# EAGLE design Digital Clock v1 (EAGLE 5.11)
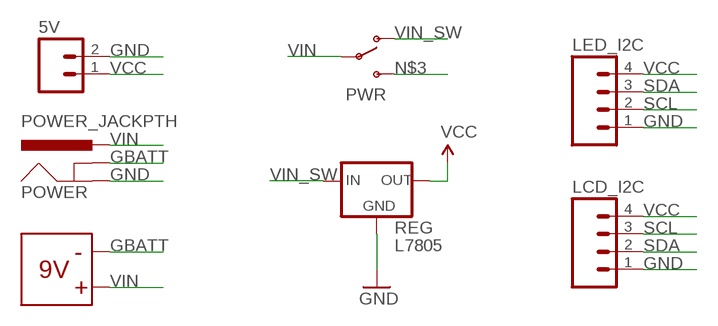
[diagram p0: schematic, sheet 1]

## Parts
5V  M02  [1X02_LONGPADS]
9V_BATTERY  BATTERY-BH9V  [BATTERY-BH9V]
LCD_I2C  M04LONGPADS  [1X04_LONGPADS]
LED_I2C  M04LONGPADS  [1X04_LONGPADS]
POWER  POWER_JACKPTH  [POWER_JACK_PTH]
PWR  SWITCH-SPSTPTH  [SWITCH-SPDT]
REG  L7805  V_REG_78XXSIDE  [78XXL]

## Nets
GBATT [supply]: 9V_BATTERY.9V- POWER.GNDBREAK
GND [supply]: 5V.2 LCD_I2C.1 LED_I2C.1 POWER.GND REG.GND
N$3: PWR.3(S)
SCL: LCD_I2C.3 LED_I2C.2
SDA: LCD_I2C.2 LED_I2C.3
VCC [supply]: 5V.1 LCD_I2C.4 LED_I2C.4 REG.OUT
VIN [supply]: 9V_BATTERY.9V+ POWER.PWR PWR.2(P)
VIN_SW [supply]: PWR.1(O) REG.IN

## Library data of the parts
5V = SparkFun:M02: Header 2 Standard 2-pin 0.1" header. Use with straight break away headers (SKU : PRT-00116), right angle break away headers (PRT-00553), swiss pins (PRT-00743), machine pins (PRT-00117), and female headers (PRT-00115). Molex polarized connector foot print use with SKU : PRT-08233 with associated crimp pins and housings.
9V_BATTERY = jcole:BATTERY-BH9V: Battery holder for 9V batteries, Digikey PN BH9V-PC-ND
LCD_I2C LED_I2C = SparkFun:M04: Header 4 Standard 4-pin 0.1" header. Use with straight break away headers (SKU : PRT-00116), right angle break away headers (PRT-00553), swiss pins (PRT-00743), machine pins (PRT-00117), and female headers (PRT-00115). Molex polarized connector foot print use with SKU : PRT-08231 with associated crimp pins and housings.
POWER = SparkFun:POWER_JACK: Power Jack This is the standard 5.5mm barrel jack for power. The PTH is the most common, proven, reliable, footprint. All others are experimental. The Slot footprint only works if the mill layer is transmitted to the PCB fab house so be warned. Spark Fun Electronics SKU : PRT-00119. Mating wall wart : TOL-00298 (and others)
PWR = SparkFun:SWITCH-SPST: SPST Switch Simple slide switch. Spark Fun Electronics SKU : COM-00102
REG = SparkFun:V_REG_78XX: Voltage Regulator Standard 7805 5V regulator. IGO (Input Ground Output). Spark Fun Electronics SKU : COM-00107

## Net classes
0 default: width 0.406 mm, clearance 0.254 mm
1 supply: width 0.762 mm, clearance 0.381 mm

## Board
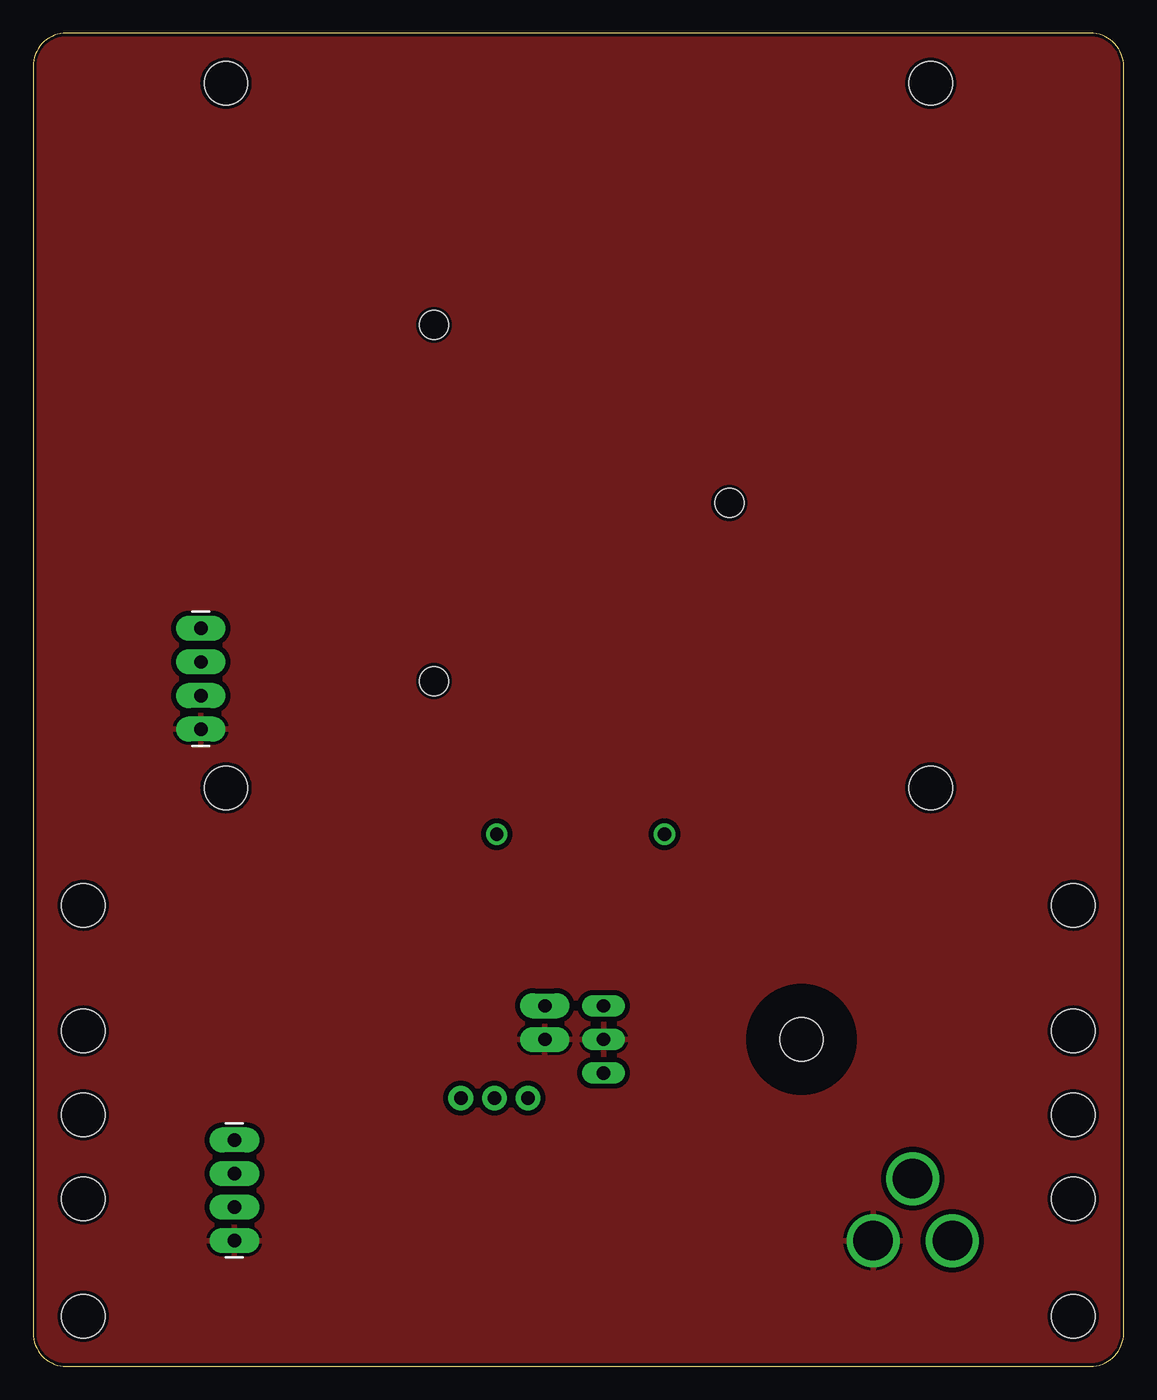
[diagram p1: board, top side]
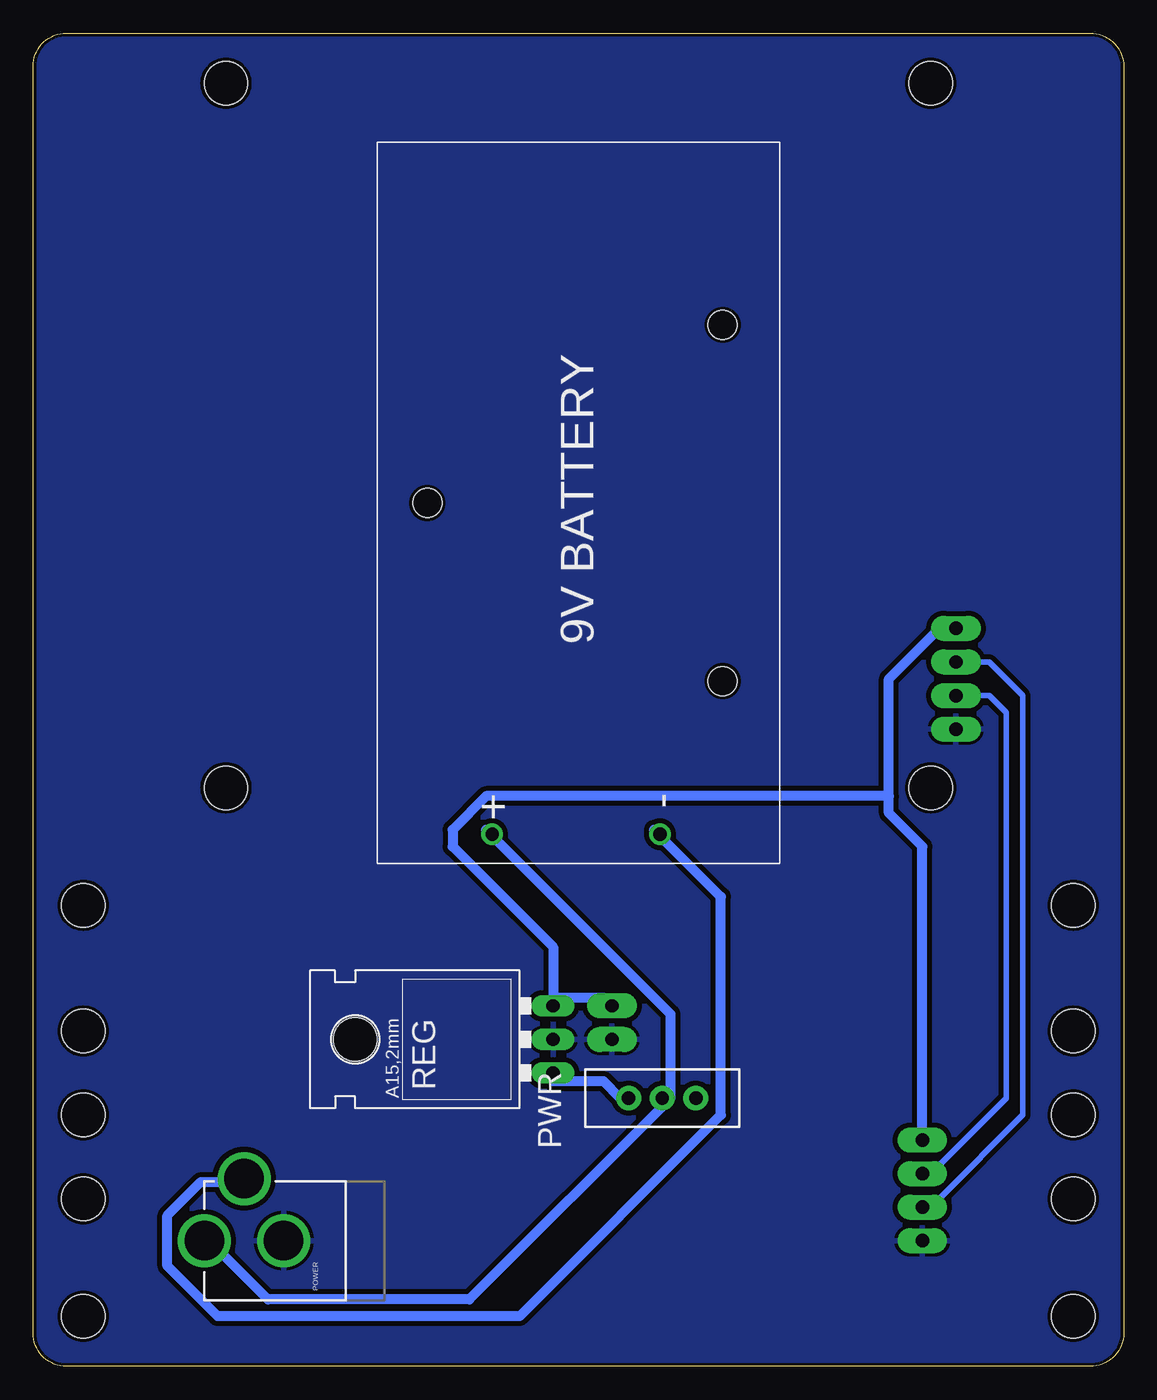
[diagram p2: board, bottom side, seen from below]

Size 82.55 x 100.97 mm. Coordinates in mm from the lower left corner, seen from the top.
Outline: 2.54,100.97 arc90 0,98.42 0,2.54 arc90 2.54,0 80.01,0 arc90 82.55,2.54 82.55,98.42 arc90 80.01,100.97 2.54,100.97
Copper layers (1*16): Top 0.035mm / dielectric 1.5mm / Bottom 0.035mm
Design rules "SparkFun": minimum track width 8mil, minimum drill 20mil, track to track 8mil, track to pad 8mil, pad to pad 8mil, via to via 8mil, smd to smd 8mil, copper to edge 10mil, drill to drill 8mil, minimum pad ring 12mil, minimum via ring 10mil, stop-mask expansion 4mil, vias tented up to drill 25mil, thermal gap 10mil

### Footprints (pad centres in the part's own frame; a part is rotated, then mirrored left to right if it is on the bottom)
1X02_LONGPADS = drill 1.016 pad 1.88 long: 1 0,0; 2 2.54,0
BATTERY-BH9V = drill 1 round: 9V+ 25.73,-6.528; 9V- 25.73,6.172 | hole 2.2: 0.66,-11.43; -12.827,10.922; 14.148,10.922
1X04_LONGPADS = drill 1.016 pad 1.88 long: 1 0,0; 2 2.54,0; 3 5.08,0; 4 7.62,0
POWER_JACK_PTH = drill 2.997 round: GND 0,7.7; GNDBREAK 4.7,10.7; PWR 0,13.7
SWITCH-SPDT = drill 1.016 pad 1.88 round: 1 0,2.54; 2 0,0; 3 0,-2.54
78XXL = drill 1.016 long: GND 0,-3.81; IN -2.54,-3.81; OUT 2.54,-3.81 | hole 3.302: 0,11.176
STAND-OFF = hole 3.302: 0,0

### Placement (x,y rotation side)
5V  38.73,27.3 270 top
9V_BATTERY  41.27,66.04 270 bottom
LCD_I2C  15.24,9.53 90 top
LED_I2C  12.7,48.26 90 top
POWER  55.88,9.53 90 bottom
PWR  34.92,20.32 90 bottom
REG  46.99,24.77 90 bottom
U$1  [STAND-OFF]  14.61,97.16 0 top
U$2  [STAND-OFF]  67.94,97.16 0 top
U$3  [STAND-OFF]  67.94,43.81 0 top
U$4  [STAND-OFF]  14.61,43.81 0 top
U$5  [STAND-OFF]  3.81,34.92 0 top
U$6  [STAND-OFF]  78.74,34.92 0 top
U$7  [STAND-OFF]  78.74,3.81 0 top
U$8  [STAND-OFF]  3.81,3.81 0 top
U$9  [STAND-OFF]  78.74,25.4 0 top
U$10  [STAND-OFF]  3.81,25.4 0 top
U$11  [STAND-OFF]  3.81,19.05 0 top
U$12  [STAND-OFF]  3.81,12.7 0 top
U$13  [STAND-OFF]  78.74,19.05 0 top
U$14  [STAND-OFF]  78.74,12.7 0 top

### Tracks (layer width: path | path; a pad name or v marks a point on that pad's centre or on a via)
GBATT
  Bottom 0.762: 9V_BATTERY.9V- 35.56,40.64 30.48,35.56 30.48,19.05 45.72,3.81 68.58,3.81 72.39,7.62 72.39,11.43 69.85,13.97 67.31,13.97 POWER.GNDBREAK
GND
  pour Bottom: 80.01,0 arc90 82.55,2.54 82.55,98.42 arc90 80.01,100.97 2.54,100.97 arc90 0,98.42 0,2.54 arc90 2.54,0
  pour Top: 80.01,0 arc90 82.55,2.54 82.55,98.42 arc90 80.01,100.97 2.54,100.97 arc90 0,98.42 0,2.54 arc90 2.54,0
SCL
  Bottom 0.406: LED_I2C.2 10.16,50.8 8.89,49.53 8.89,20.32 13.97,15.24 15.24,15.24 LCD_I2C.3
SDA
  Bottom 0.406: LED_I2C.3 10.16,53.34 7.62,50.8 7.62,19.05 13.97,12.7 15.24,12.7 LCD_I2C.2
VCC
  Bottom 0.762: 43.18,27.94 39.37,27.94 5V.1 | 17.78,43.18 17.78,52.07 13.97,55.88 LED_I2C.4 | 17.78,43.18 17.78,41.91 15.24,39.37 LCD_I2C.4 | 43.18,27.94 43.18,31.75 50.8,39.37 50.8,40.64 48.26,43.18 17.78,43.18 | 43.18,27.94 REG.OUT
VIN
  Bottom 0.762: 34.29,20.32 34.29,26.67 48.26,40.64 9V_BATTERY.9V+ | 34.29,20.32 49.53,5.08 64.77,5.08 68.58,8.89 POWER.PWR | PWR.2 34.29,20.32
VIN_SW
  Bottom 0.762: REG.IN 43.18,21.59 39.37,21.59 38.1,20.32 PWR.1

### Text on the board
tOrigins: Digital Clock v1.0 | Digital Clock v1.0
bOrigins: jeremy@jcole.us | 2011-01-29 | (c) 2010 Jeremy Cole | Digital Clock v1.0